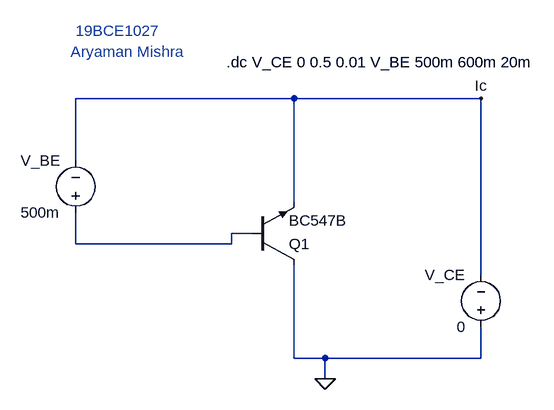
[diagram p0: schematic 6c-1.asc]
6c-1.asc, the LTspice schematic file:
Version 4
SHEET 1 880 680
WIRE 256 160 -80 160
WIRE 544 160 256 160
WIRE -80 256 -80 160
WIRE 256 320 256 160
WIRE 192 368 160 368
WIRE -80 384 -80 336
WIRE 160 384 160 368
WIRE 160 384 -80 384
WIRE 544 432 544 160
WIRE 256 560 256 416
WIRE 304 560 256 560
WIRE 544 560 544 512
WIRE 544 560 304 560
WIRE 304 592 304 560
FLAG 304 592 0
FLAG 544 160 Ic
SYMBOL npn 192 416 M180
SYMATTR InstName Q1
SYMATTR Value BC547B
SYMBOL voltage -80 352 R180
WINDOW 0 24 96 Left 2
WINDOW 3 24 16 Left 2
SYMATTR InstName V_BE
SYMATTR Value 500m
SYMBOL voltage 544 528 R180
WINDOW 0 24 96 Left 2
WINDOW 3 24 16 Left 2
SYMATTR InstName V_CE
SYMATTR Value 0
TEXT -80 56 Left 2 ;19BCE1027
TEXT -88 88 Left 2 ;Aryaman Mishra
TEXT 152 104 Left 2 !.dc V_CE 0 0.5 0.01 V_BE 500m 600m 20m

The netlist it stands for:
* 6c-1.asc
Q1 0 N001 Ic 0 BC547B
V_BE N001 Ic 500m
V_CE 0 Ic 0
.model NPN NPN
.model PNP PNP
.lib standard.bjt
* 19BCE1027
* Aryaman Mishra
.dc V_CE 0 0.5 0.01 V_BE 500m 600m 20m
.backanno
.end